# Altium schematic sheet Independent Power Supply - AMS.SchDoc
size A4
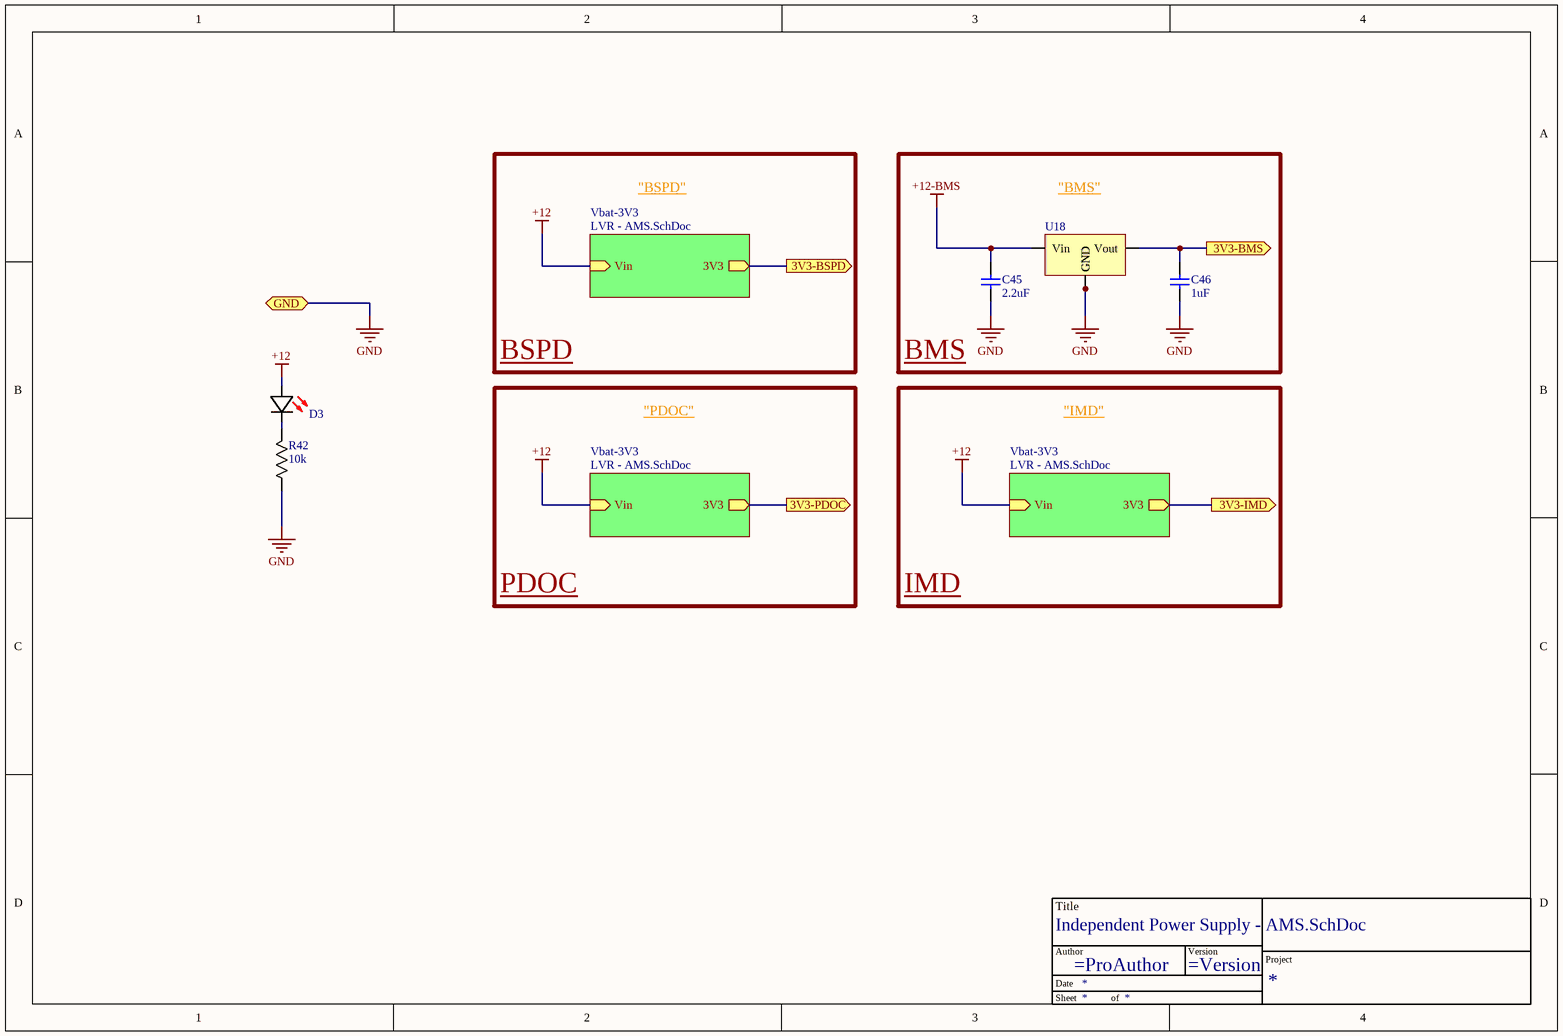
[diagram p0: Independent Power Supply - AMS.SchDoc]

## Parts
*  TitleBlock  (value not drawn)  (graphical)
C45  value 2.2uF  [C_0603]  (hidden comment: CL10A225KP8NNNC)
C46  value 1uF  [C_0603]  (hidden comment: CL10A105KP8NNNL)
D3  150060SS55040  [LED (0603)]  (value not drawn)
R42  value 10k  [R-0603]  (hidden comment: RC0603FR-1310KL)
U18  BD33C0AHFP-CTR  [HRP5]  (value not drawn)

## Blocks framed on the sheet
BMS: C45 C46 U18

## Sub-sheets
Vbat-3V3 = LVR - AMS.SchDoc: Vin (in), 3V3 (out)
Vbat-3V3 = LVR - AMS.SchDoc: Vin (in), 3V3 (out)
Vbat-3V3 = LVR - AMS.SchDoc: Vin (in), 3V3 (out)

## Ports
3V3-BMS (out), 3V3-BSPD (out), 3V3-IMD (out), 3V3-PDOC (out), GND (bidir)

## Nets
+12: D3.2(A) ; sheet Vbat-3V3/Vin, sheet Vbat-3V3/Vin, sheet Vbat-3V3/Vin
+12-BMS: C45.2 U18.1(Vin)
GND: C45.1 C46.1 R42.1 U18.3(GND) U18.6(GND) ; port GND
3V3-BMS: C46.2 U18.5(Vout) ; port 3V3-BMS
3V3-BSPD: port 3V3-BSPD, sheet Vbat-3V3/3V3
3V3-IMD: port 3V3-IMD, sheet Vbat-3V3/3V3
3V3-PDOC: port 3V3-PDOC, sheet Vbat-3V3/3V3
NetD3_1: D3.1(K) R42.2

## Notes on the sheet
- "BSPD"
- (near U18) "BMS"
- BSPD
- "PDOC"
- "IMD"
- PDOC
- IMD
- (in symbol TitleBlock) Title; Author; Version; Project; Date; Sheet; of

## Library data of the parts
C45 C46 = Capacitor: ComponentLink1Description: New link; ComponentLink1URL: *
D3 = 150060SS55040: LED RED DIFFUSED 0603 SMD; Manufacturer: Wurth Electronics; Lens Style: Flat; Luminous Intensity: 70mcd; Forward Voltage: 2V; Test Current: 20mA; Viewing Angle: 140°; Dominant Wavelength: 630nm; Lens Size: 0.8mm; Supplier 1: Mouser; Manufacturer Part Number: 150060SS55040; RoHS: No; Category: LEDs; Stock 1: 17006; Pricing 1: 1=0.18000, 10=0.16800, 50=0.16800, 100=0.15200, 1000=0.12100, 10000=0.10600 (USD); Mount: Surface Mount; Case/Package: 0603; Color: Red; Case Code (Imperial): 0603; Case Code (Metric): 1608; Packaging: Tape and Reel; Lens Transparency: Diffused; Length: 1.6mm; Width: 0.8mm; Height: 0.5mm; RoHS Compliant: No; Supplier Part Number 1: 710-150060SS55040
R42 = Resistor
U18 = BD33C0AHFP-CTR: LDO Voltage Regulators 35V RESIS 1A LDO REGULATOR